# EAGLE design untitled (EAGLE 8.6.0)
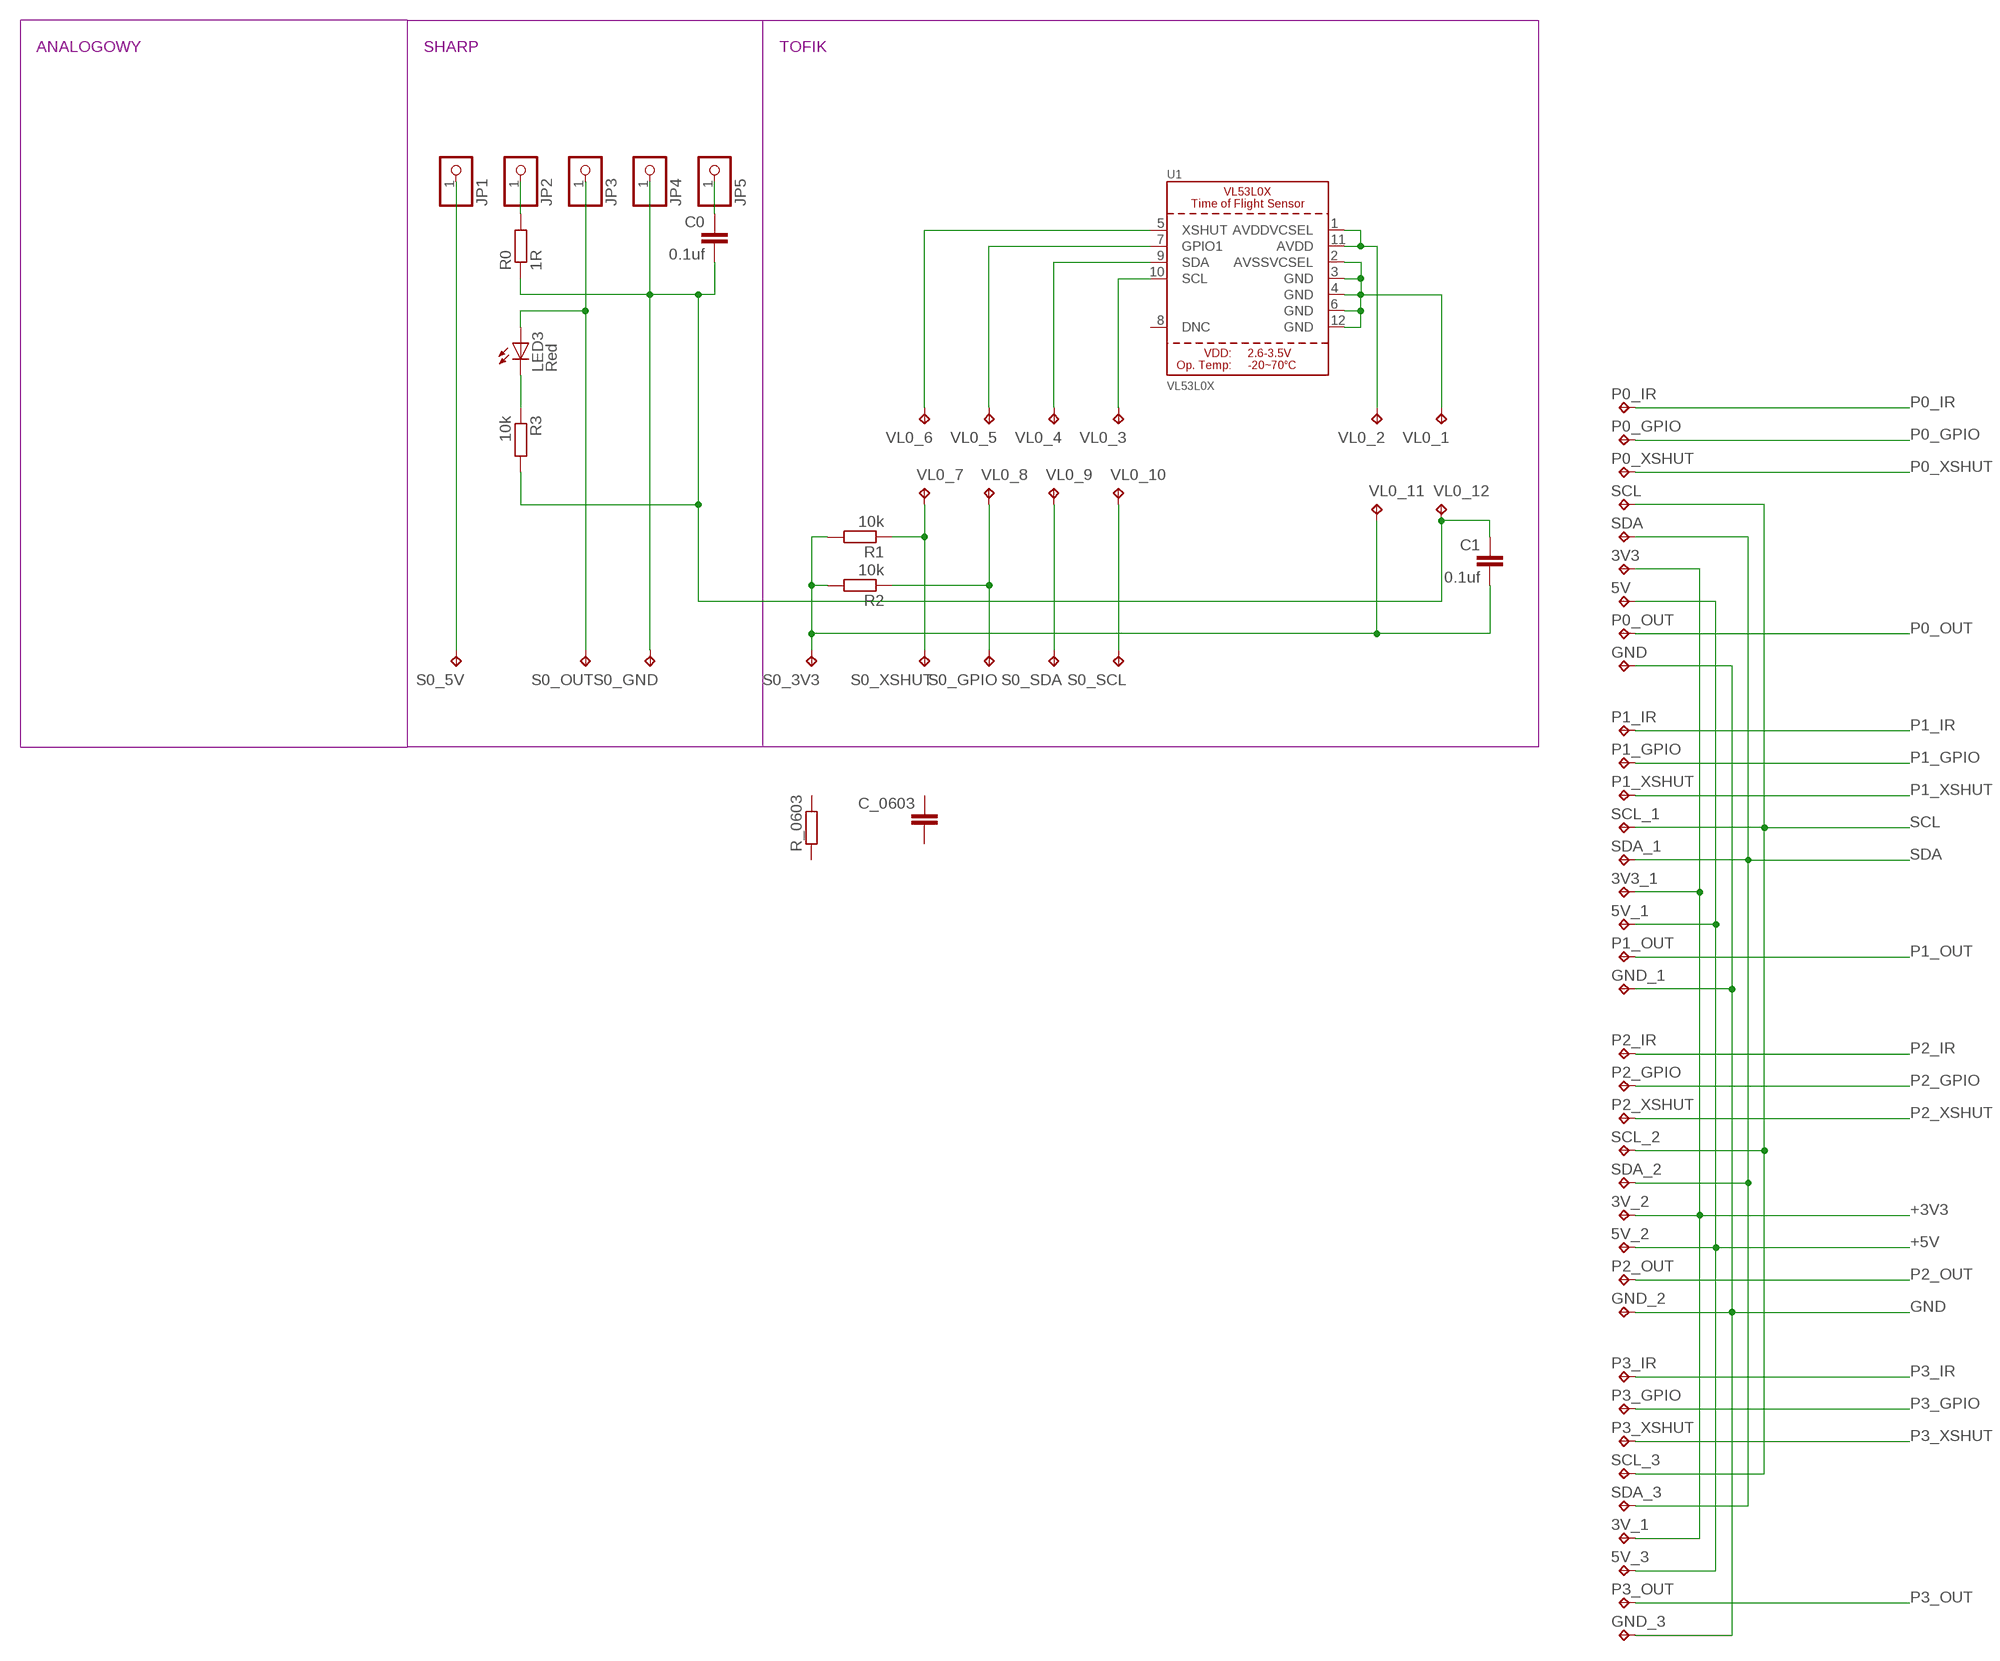
[diagram p0: schematic, sheet 1, part 1 of 2]
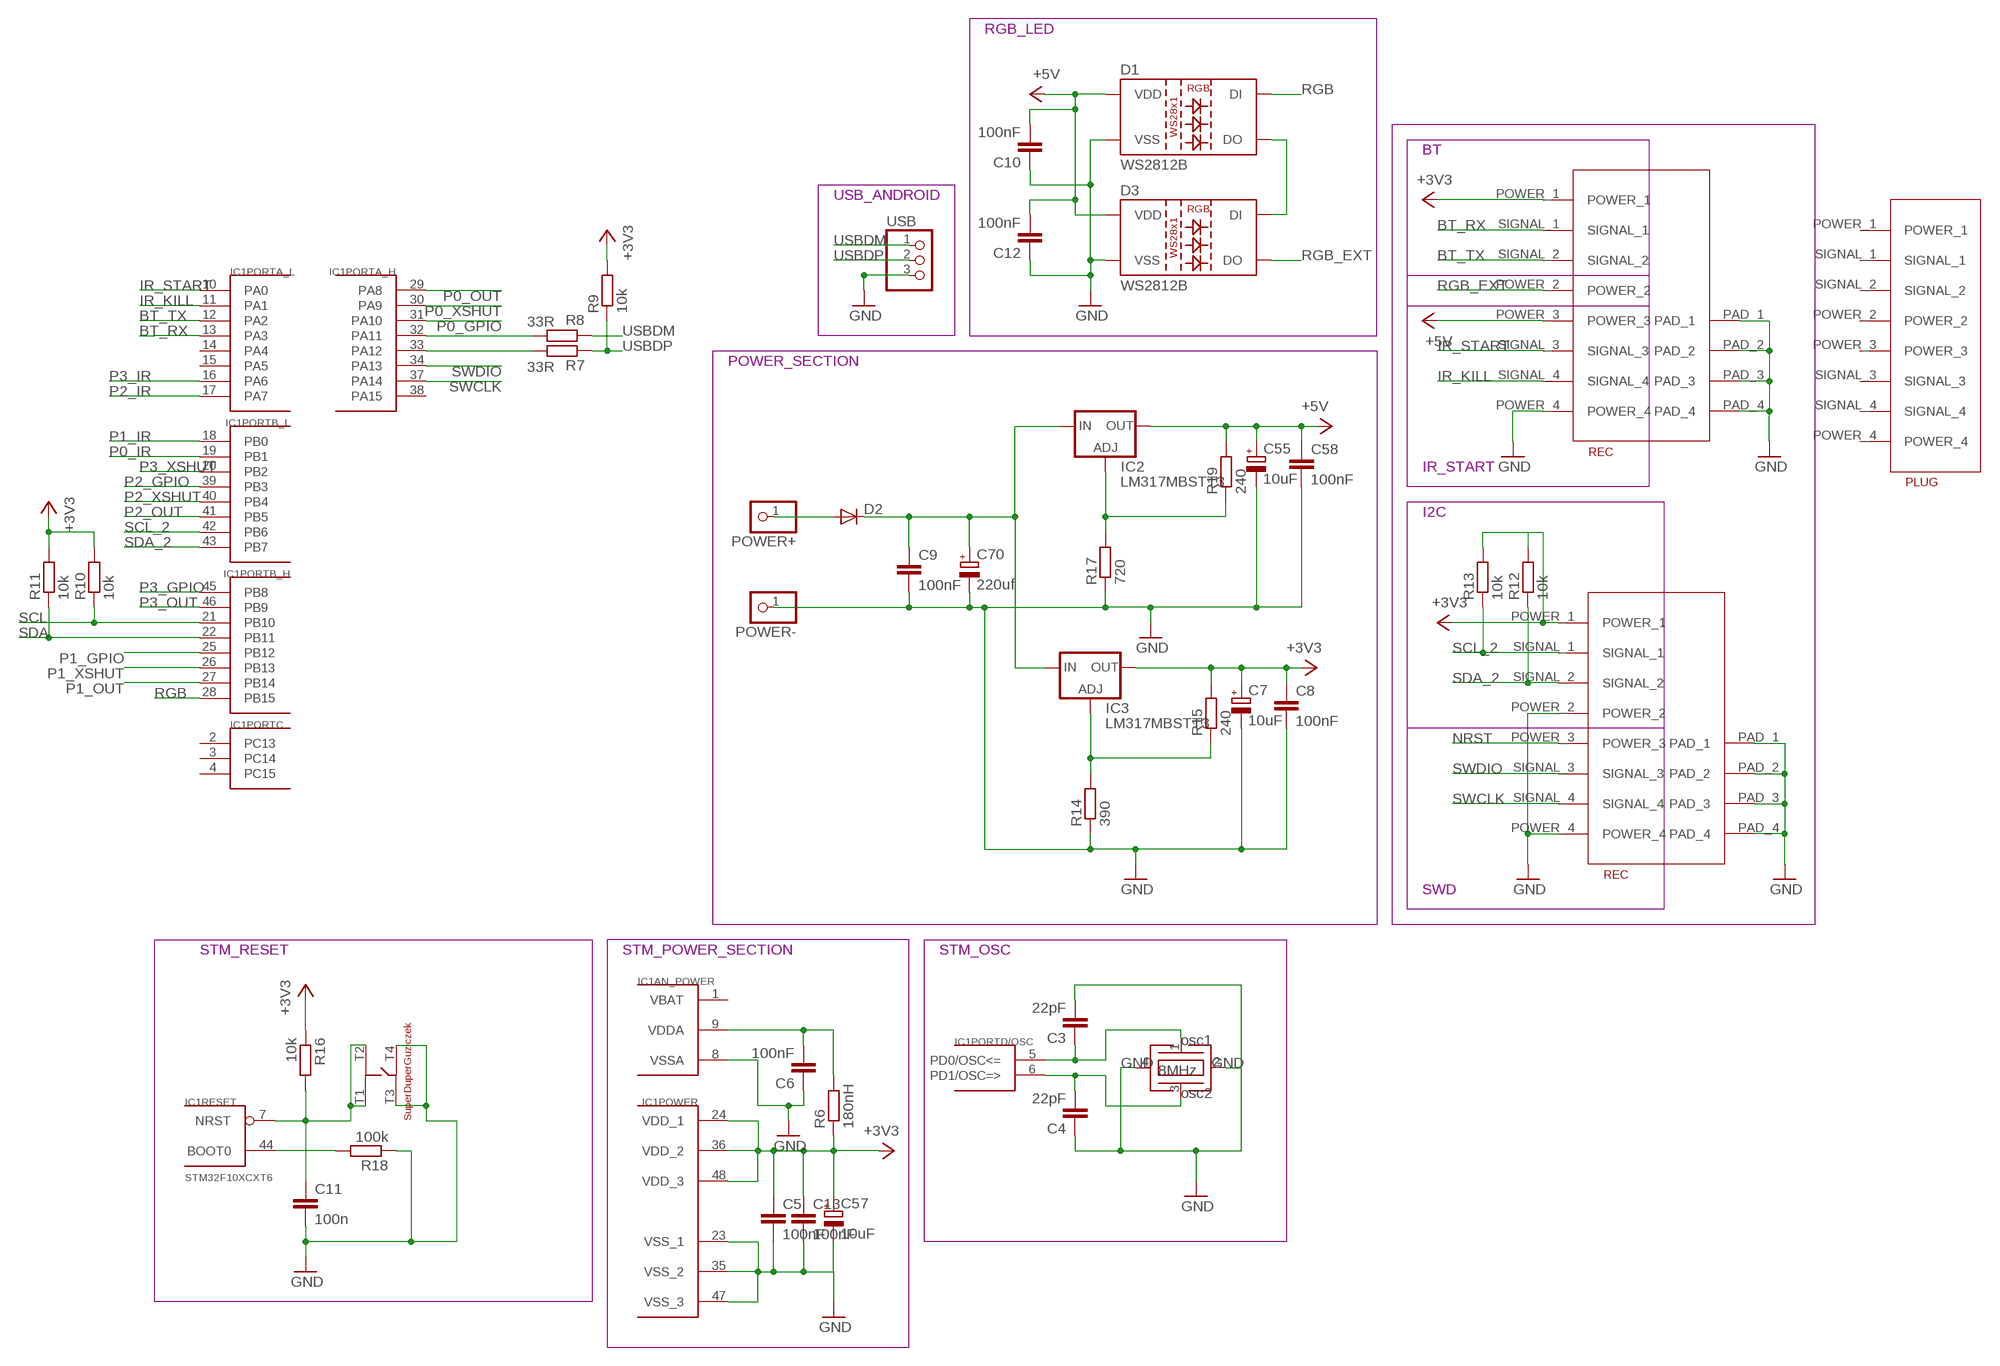
[diagram p1: schematic, sheet 1, part 2 of 2]

## Parts
3V3  TPTP09SQ  [TP09SQ]
3V3_1  TPTP09SQ  [TP09SQ]
3V_1  TPTP09SQ  [TP09SQ]
3V_2  TPTP09SQ  [TP09SQ]
5V  TPTP09SQ  [TP09SQ]
5V_1  TPTP09SQ  [TP09SQ]
5V_2  TPTP09SQ  [TP09SQ]
5V_3  TPTP09SQ  [TP09SQ]
C0  0.1uf  C-EUC0603  [C0603]
C1  0.1uf  C-EUC0603  [C0603]
C3  22pF  C-EUC0603  [C0603]
C4  22pF  C-EUC0603  [C0603]
C5  100nF  C-EUC0603  [C0603]
C6  100nF  C-EUC0603  [C0603]
C7  10uF  CPOL-EUSMCA  [SMC_A]
C8  100nF  C-EUC0603  [C0603]
C9  100nF  C-EUC0603  [C0603]
C10  100nF  C-EUC0603  [C0603]
C11  100n  C-EUC0603  [C0603]
C12  100nF  C-EUC0603  [C0603]
C13  100nF  C-EUC0603  [C0603]
C55  10uF  CPOL-EUSMCA  [SMC_A]
C57  10uF  CPOL-EUSMCA  [SMC_A]
C58  100nF  C-EUC0603  [C0603]
C70  220uf  CPOL-EU150CLZ-0810  [150CLZ-0810]
C_0603  C-EUC0603  [C0603]
D1  WS2812B  [WS2812B]
D2  DIODE-DO214BA  [DO214BA]
D3  WS2812B  [WS2812B]
GND  TPTP09SQ  [TP09SQ]
GND_1  TPTP09SQ  [TP09SQ]
GND_2  TPTP09SQ  [TP09SQ]
GND_3  TPTP09SQ  [TP09SQ]
IC1  STM32F10XCXT6  [TQFP48]
IC2  LM317MBSTT3  [SOT223]
IC3  LM317MBSTT3  [SOT223]
JP1  PINHD-1X1  [1X01]
JP2  PINHD-1X1  [1X01]
JP3  PINHD-1X1  [1X01]
JP4  PINHD-1X1  [1X01]
JP5  PINHD-1X1  [1X01]
LED3  Red  LEDSML0603  [SML0603]
P0_GPIO  TPTP09SQ  [TP09SQ]
P0_IR  TPTP09SQ  [TP09SQ]
P0_OUT  TPTP09SQ  [TP09SQ]
P0_XSHUT  TPTP09SQ  [TP09SQ]
P1_GPIO  TPTP09SQ  [TP09SQ]
P1_IR  TPTP09SQ  [TP09SQ]
P1_OUT  TPTP09SQ  [TP09SQ]
P1_XSHUT  TPTP09SQ  [TP09SQ]
P2_GPIO  TPTP09SQ  [TP09SQ]
P2_IR  TPTP09SQ  [TP09SQ]
P2_OUT  TPTP09SQ  [TP09SQ]
P2_XSHUT  TPTP09SQ  [TP09SQ]
P3_GPIO  TPTP09SQ  [TP09SQ]
P3_IR  TPTP09SQ  [TP09SQ]
P3_OUT  TPTP09SQ  [TP09SQ]
P3_XSHUT  TPTP09SQ  [TP09SQ]
POWER+  PINHD-1X1  [1X01]
POWER-  PINHD-1X1  [1X01]
R0  1R  R-EU_R0603  [R0603]
R1  10k  R-EU_R0603  [R0603]
R2  10k  R-EU_R0603  [R0603]
R3  10k  R-EU_R0603  [R0603]
R6  180nH  R-EU_R0603  [R0603]
R7  33R  R-EU_R0603  [R0603]
R8  33R  R-EU_R0603  [R0603]
R9  10k  R-EU_R0603  [R0603]
R10  10k  R-EU_R0603  [R0603]
R11  10k  R-EU_R0603  [R0603]
R12  10k  R-EU_R0603  [R0603]
R13  10k  R-EU_R0603  [R0603]
R14  390  R-EU_R0603  [R0603]
R15  240  R-EU_R0603  [R0603]
R16  10k  R-EU_R0603  [R0603]
R17  720  R-EU_R0603  [R0603]
R18  100k  R-EU_R0603  [R0603]
R19  240  R-EU_R0603  [R0603]
R_0603  R-EU_R0603  [R0603]
S0_3V3  TPTP09SQ  [TP09SQ]
S0_5V  TPTP09SQ  [TP09SQ]
S0_GND  TPTP09SQ  [TP09SQ]
S0_GPIO  TPTP09SQ  [TP09SQ]
S0_OUT  TPTP09SQ  [TP09SQ]
S0_SCL  TPTP09SQ  [TP09SQ]
S0_SDA  TPTP09SQ  [TP09SQ]
S0_XSHUT  TPTP09SQ  [TP09SQ]
SCL  TPTP09SQ  [TP09SQ]
SCL_1  TPTP09SQ  [TP09SQ]
SCL_2  TPTP09SQ  [TP09SQ]
SCL_3  TPTP09SQ  [TP09SQ]
SDA  TPTP09SQ  [TP09SQ]
SDA_1  TPTP09SQ  [TP09SQ]
SDA_2  TPTP09SQ  [TP09SQ]
SDA_3  TPTP09SQ  [TP09SQ]
U1  VL53L0X  [LGA12_ST]
U$1  MOLEG_REC_8X0.4MM  [REC]
U$2  MOLEX_PLUG_8X0.4MM  [PLUG]
U$3  MOLEG_REC_8X0.4MM  [REC]
U$27  SUPER_DUPER_GUZICZEK  [SUPER_DUPER_GUZICZEK]
U$35  8MHZ  [SMD]
USB  PINHD-1X3  [1X03]
VL0_1  TPTP09SQ  [TP09SQ]
VL0_2  TPTP09SQ  [TP09SQ]
VL0_3  TPTP09SQ  [TP09SQ]
VL0_4  TPTP09SQ  [TP09SQ]
VL0_5  TPTP09SQ  [TP09SQ]
VL0_6  TPTP09SQ  [TP09SQ]
VL0_7  TPTP09SQ  [TP09SQ]
VL0_8  TPTP09SQ  [TP09SQ]
VL0_9  TPTP09SQ  [TP09SQ]
VL0_10  TPTP09SQ  [TP09SQ]
VL0_11  TPTP09SQ  [TP09SQ]
VL0_12  TPTP09SQ  [TP09SQ]

## Nets
+3V3: 3V3.TP 3V3_1.TP 3V_1.TP 3V_2.TP C5.1 C7.+ C8.1 C13.1 C57.+ IC1.24(POWER:VDD_1) IC1.36(POWER:VDD_2) IC1.48(POWER:VDD_3) IC3.4(OUT) R6.1 R9.2 R10.2 R11.2 R12.2 R13.2 R15.2 R16.1 U$1.POWER_1 U$3.POWER_1
+5V: 5V.TP 5V_1.TP 5V_2.TP 5V_3.TP C10.2 C12.2 C55.+ C58.1 D1.1(VDD) D3.1(VDD) IC2.4(OUT) R19.2 U$1.POWER_3
BT_RX: IC1.13(PORTA_L:PA3) U$1.SIGNAL_1
BT_TX: IC1.12(PORTA_L:PA2) U$1.SIGNAL_2
GND: C3.2 C4.1 C5.2 C6.1 C7.- C8.2 C9.2 C10.1 C11.2 C12.1 C13.2 C55.- C57.- C58.2 C70.- D1.3(VSS) D3.3(VSS) GND.TP GND_1.TP GND_2.TP GND_3.TP IC1.8(AN_POWER:VSSA) IC1.23(POWER:VSS_1) IC1.35(POWER:VSS_2) IC1.47(POWER:VSS_3) POWER-.1 R14.1 R17.1 R18.1 U$1.PAD_1 U$1.PAD_2 U$1.PAD_3 U$1.PAD_4 U$1.POWER_4 U$3.PAD_1 U$3.PAD_2 U$3.PAD_3 U$3.PAD_4 U$3.POWER_2 U$3.POWER_4 U$27.T3 U$27.T4 U$35.2(GND2) U$35.4(GND1) USB.3
GND_TOFIK: U1.2(AVSSVCSEL) U1.3(GND) U1.4(GND) U1.6(GND) U1.12(GND) VL0_1.TP
IR_KILL: IC1.11(PORTA_L:PA1) U$1.SIGNAL_4
IR_START: IC1.10(PORTA_L:PA0) U$1.SIGNAL_3
N$1: JP2.1 R0.2
N$2: C0.1 JP5.1
N$4: LED3.C R3.1
N$15: U1.10(SCL) VL0_3.TP
N$16: U1.1(AVDDVCSEL) U1.11(AVDD) VL0_2.TP
N$17: U1.9(SDA) VL0_4.TP
N$18: U1.7(GPIO1) VL0_5.TP
N$19: U1.5(XSHUT) VL0_6.TP
N$74: IC3.1(ADJ) R14.2 R15.1
N$75: D2.A POWER+.1
N$76: C9.1 C70.+ D2.C IC2.3(IN) IC3.3(IN)
N$78: IC2.1(ADJ) R17.2 R19.1
N$79: IC1.44(RESET:BOOT0) R18.2
N$81: D1.2(DO) D3.4(DI)
N$128: IC1.33(PORTA_H:PA12) R7.2
N$129: IC1.32(PORTA_H:PA11) R8.2
N$130: C6.2 IC1.9(AN_POWER:VDDA) R6.2
N$131: C3.1 IC1.5(PORTD/OSC:PD0/OSC<=) U$35.1
N$132: C4.2 IC1.6(PORTD/OSC:PD1/OSC=>) U$35.3
NRST: C11.1 IC1.7(RESET:NRST) R16.2 U$3.POWER_3 U$27.T1 U$27.T2
P0_GPIO: IC1.31(PORTA_H:PA10) P0_GPIO.TP
P0_IR: IC1.19(PORTB_L:PB1) P0_IR.TP
P0_OUT: IC1.29(PORTA_H:PA8) P0_OUT.TP
P0_XSHUT: IC1.30(PORTA_H:PA9) P0_XSHUT.TP
P1_GPIO: IC1.25(PORTB_H:PB12) P1_GPIO.TP
P1_IR: IC1.18(PORTB_L:PB0) P1_IR.TP
P1_OUT: IC1.27(PORTB_H:PB14) P1_OUT.TP
P1_XSHUT: IC1.26(PORTB_H:PB13) P1_XSHUT.TP
P2_GPIO: IC1.39(PORTB_L:PB3) P2_GPIO.TP
P2_IR: IC1.17(PORTA_L:PA7) P2_IR.TP
P2_OUT: IC1.41(PORTB_L:PB5) P2_OUT.TP
P2_XSHUT: IC1.40(PORTB_L:PB4) P2_XSHUT.TP
P3_GPIO: IC1.45(PORTB_H:PB8) P3_GPIO.TP
P3_IR: IC1.16(PORTA_L:PA6) P3_IR.TP
P3_OUT: IC1.46(PORTB_H:PB9) P3_OUT.TP
P3_XSHUT: IC1.20(PORTB_L:PB2) P3_XSHUT.TP
RGB: D1.4(DI) IC1.28(PORTB_H:PB15)
RGB_EXT: D3.2(DO) U$1.POWER_2
S0_3V3: C1.2 R1.2 R2.2 S0_3V3.TP VL0_11.TP
S0_5V: JP1.1 S0_5V.TP
S0_GND: C0.2 C1.1 JP4.1 R0.1 R3.2 S0_GND.TP VL0_12.TP
S0_GPIO: R2.1 S0_GPIO.TP VL0_8.TP
S0_OUT: JP3.1 LED3.A S0_OUT.TP
S0_SCL: S0_SCL.TP VL0_10.TP
S0_SDA: S0_SDA.TP VL0_9.TP
S0_XSHUT: R1.1 S0_XSHUT.TP VL0_7.TP
SCL: IC1.21(PORTB_H:PB10) R10.1 SCL.TP SCL_1.TP SCL_2.TP SCL_3.TP
SCL_2: IC1.42(PORTB_L:PB6) R13.1 U$3.SIGNAL_1
SDA: IC1.22(PORTB_H:PB11) R11.1 SDA.TP SDA_1.TP SDA_2.TP SDA_3.TP
SDA_2: IC1.43(PORTB_L:PB7) R12.1 U$3.SIGNAL_2
SWCLK: IC1.37(PORTA_H:PA14) U$3.SIGNAL_4
SWDIO: IC1.34(PORTA_H:PA13) U$3.SIGNAL_3
USBDM: R8.1 USB.1
USBDP: R7.1 R9.1 USB.2
Unconnected: C_0603.1 C_0603.2 IC1.2(PORTC:PC13) IC1.3(PORTC:PC14) IC1.4(PORTC:PC15) IC1.14(PORTA_L:PA4) IC1.15(PORTA_L:PA5) IC1.38(PORTA_H:PA15) R_0603.1 R_0603.2 U1.8(DNC) U$2.POWER_1 U$2.POWER_2 U$2.POWER_3 U$2.POWER_4 U$2.SIGNAL_1 U$2.SIGNAL_2 U$2.SIGNAL_3 U$2.SIGNAL_4

## Notes on the sheet
- ANALOGOWY | SHARP | TOFIK
- RGB_LED
- BT
- USB_ANDROID
- POWER_SECTION
- IR_START
- I2C
- SWD
- STM_RESET | STM_POWER_SECTION | STM_OSC

## Power pins joined to a net without a drawn wire
VBAT: IC1.1(AN_POWER:VBAT)

## Library data of the parts
3V3 3V3_1 3V_1 3V_2 5V 5V_1-5V_3 GND GND_1-GND_3 P0_GPIO P0_IR P0_OUT P0_XSHUT P1_GPIO P1_IR P1_OUT P1_XSHUT P2_GPIO P2_IR P2_OUT P2_XSHUT P3_GPIO P3_IR P3_OUT P3_XSHUT S0_3V3 S0_5V S0_GND S0_GPIO S0_OUT S0_SCL S0_SDA S0_XSHUT SCL SCL_1-SCL_3 SDA SDA_1-SDA_3 VL0_1-VL0_12 = testpad:TP: Test pad
C0 C1 C3-C6 C8-C13 C58 C_0603 = rcl:C-EU: CAPACITOR, European symbol; SPICEPREFIX: C
C7 C55 C57 C70 = rcl:CPOL-EU: POLARIZED CAPACITOR, European symbol; SPICEPREFIX: C
D1 D3 = SparkFun-LED:WS2812B: WS2812B SMD addressable RGB LED 5x5mm SMD LED with built-in controller IC. Color: Red/Green/Blue mC Rating: RGB: 390, 660, 180 mcd Forward Voltage: RGB: 2.0, 3.0, 3.0 V Packages:WS2812B SparkFun Products: Blynk Board - ESP8266 <https://www.sparkfun.com/products/13794>; PROD_ID: DIO-12503
D2 = diode:DIODE-: DIODE
IC1 = stm32:STM32F10XCXT6: ST STM32F101/103 48pin LQFP
IC2 IC3 = v-reg:LM317?*: 500 mA Adjustable Output Positive Voltage Regulator Source: http://www.onsemi.co.jp .. LM317M-D.PDF
JP1-JP5 POWER+ POWER- = adafruit:PINHD-1X1: Pin header 1x1 for 0.1" spacing With round pins
LED3 = led:LED: LED OSRAM: - CHIPLED LG R971, LG N971, LY N971, LG Q971, LY Q971, LO R971, LY R971 LH N974, LH R974 LS Q976, LO Q976, LY Q976 LO Q996 - Hyper CHIPLED LW Q18S LB Q993, LB Q99A, LB R99A - SideLED LS A670, LO A670, LY A670, LG A670, LP A670 LB A673, LV A673, LT A673, LW A673 LH A674 LY A675 LS A676, LA A676, LO A676, LY A676, LW A676 LS A679, LY A679, LG A679 - Hyper Micro SIDELED® LS Y876, LA Y876, LO Y876, LY Y876 LT Y87S - SmartLED LW L88C, LW L88S LB L89C, LB L89S, LG L890 LS L89K, LO L89K, LY L89K LS L896, LA L896, LO L896, LY L896 - TOPLED LS T670, LO T670, LY T670, LG T670, LP T670 LSG T670, LSP T670, LSY T670, LOP T670, LYG T670 LG T671, LOG T671, LSG T671 LB T673, LV T673, LT T673, LW T673 LH T674 LS T676, LA T676, LO T676, LY T676, LB T676, LH T676, LSB T676, LW T676 LB T67C, LV T67C, LT T67C, LS T67K, LO T67K, LY T67K, LW E67C LS E67B, LA E67B, LO E67B, LY E67B, LB E67C, LV E67C, LT E67C LW T67C LS T679, LY T679, LG T679 LS T770, LO T770, LY T770, LG T770, LP T770 LB T773, LV T773, LT T773, LW T773 LH T774 LS E675, LA E675, LY E675, LS T675 LS T776, LA T776, LO T776, LY T776, LB T776 LHGB T686 LT T68C, LB T68C - Hyper Mini TOPLED® LB M676 - Mini TOPLED Santana® LG M470 LS M47K, LO M47K, LY M47K Source: http://www.osram.convergy.de LUXEON: - LUMILED® LXK2-PW12-R00, LXK2-PW12-S00, LXK2-PW14-U00, LXK2-PW14-V00 LXK2-PM12-R00, LXK2-PM12-S00, LXK2-PM14-U00 LXK2-PE12-Q00, LXK2-PE12-R00, LXK2-PE12-S00, LXK2-PE14-T00, LXK2-PE14-U00 LXK2-PB12-K00, LXK2-PB12-L00, LXK2-PB12-M00, LXK2-PB14-N00, LXK2-PB14-P00, LXK2-PB14-Q00 LXK2-PR12-L00, LXK2-PR12-M00, LXK2-PR14-Q00, LXK2-PR14-R00 LXK2-PD12-Q00, LXK2-PD12-R00, LXK2-PD12-S00 LXK2-PH12-R00, LXK2-PH12-S00 LXK2-PL12-P00, LXK2-PL12-Q00, LXK2-PL12-R00 Source: www.luxeon.com KINGBRIGHT: KA-3528ASYC Source: www.kingbright.com
R0 R1-R3 R6-R19 R_0603 = resistor:R-EU_: RESISTOR, European symbol
U1 = microbuilder:VL53L0X: VL53L0X - Laser Time of Flight Sensor (2M range)
U$1 U$3 = MOLEX:MOLEG_REC_8X0.4MM
U$2 = MOLEX:MOLEX_PLUG_8X0.4MM
U$27 = SuperDuperGuziczek:SUPER_DUPER_GUZICZEK
U$35 = cfpx-104-8mhz:8MHZ
USB = adafruit:PINHD-1X3: PIN HEADER

## Board
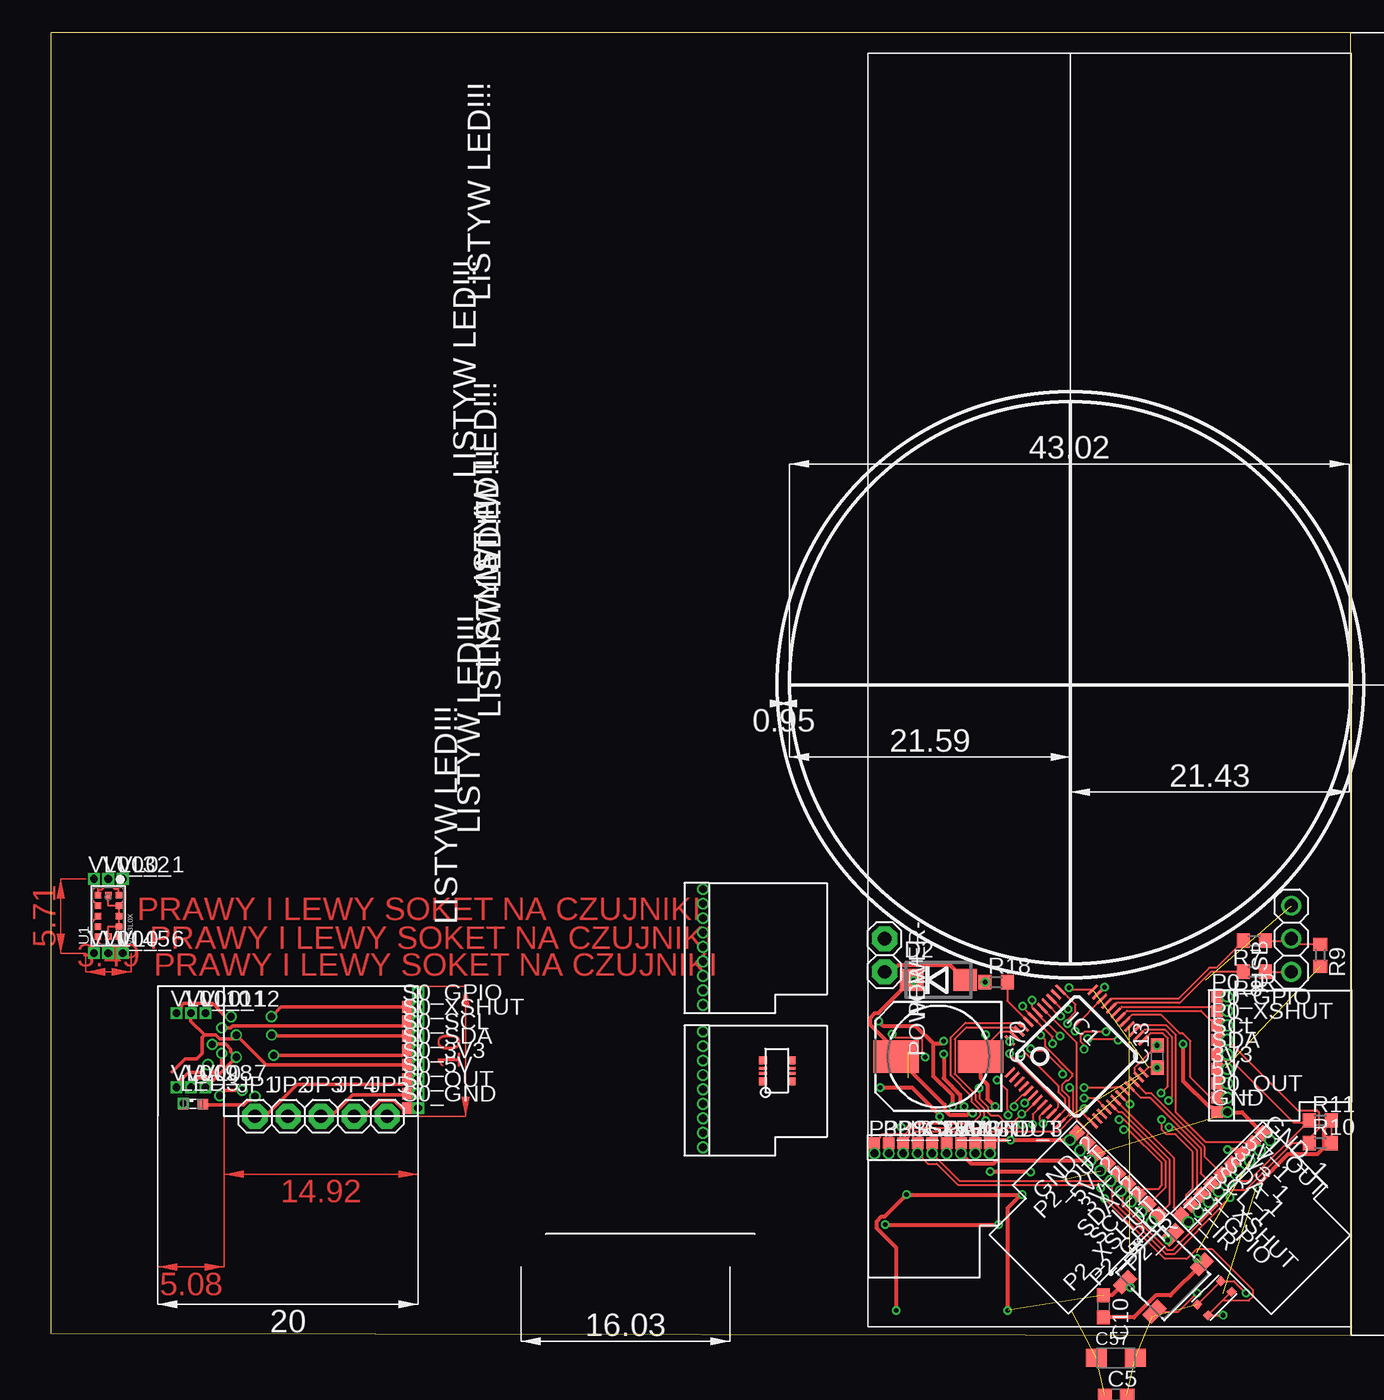
[diagram p2: board, top side]
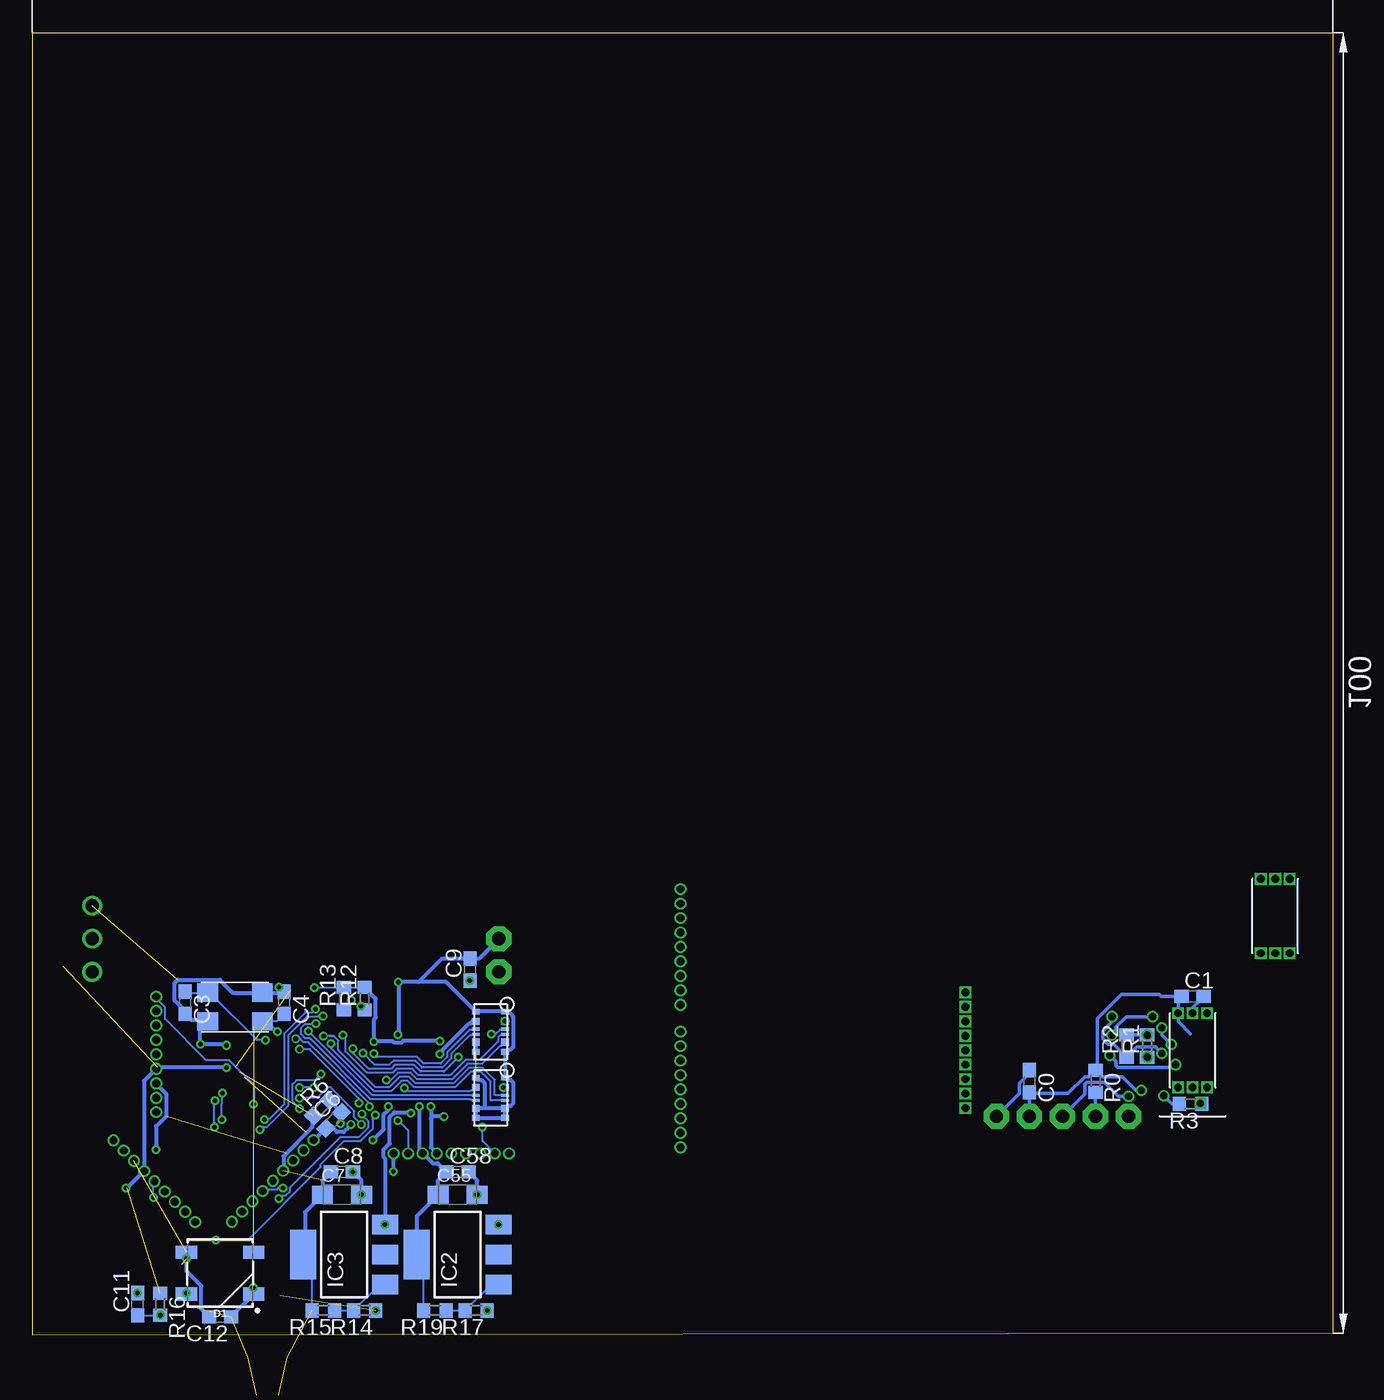
[diagram p3: board, bottom side, seen from below]

Size 99.99 x 100.16 mm. Coordinates in mm from the lower left corner, seen from the top.
Outline: 0,0.16 99.99,0 99.99,100.16 0,100.16 0,0.16
Copper layers (1*16): Top 0.035mm / dielectric 1.5mm / Bottom 0.035mm
Design rules "default *": minimum track width 6mil, minimum drill 0.35mm, track to track 6mil, track to pad 6mil, pad to pad 6mil, via to via 6mil, smd to smd 6mil, copper to edge 6mil, drill to drill 6mil, minimum pad ring 6mil, minimum via ring 6mil, stop-mask expansion 4mil, vias tented up to drill 0mil, thermal gap 10mil

### Footprints (pad centres in the part's own frame; a part is rotated, then mirrored left to right if it is on the bottom)
TP09SQ = smd 0.9 x 0.9: TP 0,0
C0603 = smd 1.1 x 1: 1 -0.85,0; 2 0.85,0
SMC_A = smd 1.6 x 1.4: + -1.5,0; - 1.5,0
150CLZ-0810 = smd 3.5 x 2.5: + 3.25,0; - -3.25,0
WS2812B = smd 1.651 x 1: 1 2.577,-1.6; 2 2.577,1.6; 3 -2.577,1.6; 4 -2.577,-1.6
DO214BA = smd 1.8 x 1.7: A 2.05,0; C -2.05,0
TQFP48 = smd 0.2 x 1: 1 -2.75,-4.5; 2 -2.25,-4.5; 3 -1.75,-4.5; 4 -1.25,-4.5; 5 -0.75,-4.5; 6 -0.25,-4.5; 7 0.25,-4.5; 8 0.75,-4.5; 9 1.25,-4.5; 10 1.75,-4.5; 11 2.25,-4.5; 12 2.75,-4.5; 25 2.75,4.5; 26 2.25,4.5; 27 1.75,4.5; 28 1.25,4.5; 29 0.75,4.5; 30 0.25,4.5; 31 -0.25,4.5; 32 -0.75,4.5; 33 -1.25,4.5; 34 -1.75,4.5; 35 -2.25,4.5; 36 -2.75,4.5 | smd 1 x 0.2: 13 4.5,-2.75; 14 4.5,-2.25; 15 4.5,-1.75; 16 4.5,-1.25; 17 4.5,-0.75; 18 4.5,-0.25; 19 4.5,0.25; 20 4.5,0.75; 21 4.5,1.25; 22 4.5,1.75; 23 4.5,2.25; 24 4.5,2.75; 37 -4.5,2.75; 38 -4.5,2.25; 39 -4.5,1.75; 40 -4.5,1.25; 41 -4.5,0.75; 42 -4.5,0.25; 43 -4.5,-0.25; 44 -4.5,-0.75; 45 -4.5,-1.25; 46 -4.5,-1.75; 47 -4.5,-2.25; 48 -4.5,-2.75
SOT223 = smd 1.5 x 2: 1 -2.3,-3.15; 2 0,-3.15; 3 2.3,-3.15 | smd 3.8 x 2: 4 0,3.15
1X01 = drill 1.016 pad 1.93 octagon: 1 0,0
SML0603 = smd 0.8 x 0.8: A 0.75,0; C -0.75,0
R0603 = smd 1 x 1.1: 1 -0.85,0; 2 0.85,0
LGA12_ST = smd 0.5 x 0.5: 1 1.6,-0.8; 2 0.8,-0.8; 3 0,-0.8; 4 -0.8,-0.8; 5 -1.6,-0.8; 6 -1.6,0; 7 -1.6,0.8; 8 -0.8,0.8; 9 0,0.8; 10 0.8,0.8; 11 1.6,0.8; 12 1.6,0
REC = smd 0.45 x 0.6: PAD_1 -0.75,0; PAD_2 2.35,0; PAD_3 -0.75,-2.25; PAD_4 2.35,-2.25 | smd 0.55 x 0.6: POWER_1 0,0; POWER_2 1.6,0; POWER_3 0,-2.25; POWER_4 1.6,-2.25 | smd 0.24 x 0.6: SIGNAL_1 0.6,0; SIGNAL_2 1,0; SIGNAL_3 0.6,-2.25; SIGNAL_4 1,-2.25
PLUG = smd 0.62 x 0.6: POWER_1 0,0; POWER_2 1.6,0; POWER_3 0,-2.2; POWER_4 1.6,-2.2 | smd 0.24 x 0.6: SIGNAL_1 0.6,0; SIGNAL_2 1,0; SIGNAL_3 0.6,-2.2; SIGNAL_4 1,-2.2
SUPER_DUPER_GUZICZEK = smd 0.57 x 0.55: T1 0,0; T2 2.55,0; T3 0,-1.16; T4 2.55,-1.16
SMD = smd 1.6 x 1.4: 1 0,2.2; 2 4.2,2.2; 3 4.2,0; 4 0,0
1X03 = drill 1.016: 1 -2.54,0; 2 0,0; 3 2.54,0

### Placement (x,y rotation side)
3V3  89.69,20.48 0 top
3V3_1  90.85,13.18 315 top
3V_1  68.9,14.76 0 top
3V_2  81.29,13.21 225 top
5V  89.69,19.37 0 top
5V_1  91.63,13.97 315 top
5V_2  80.5,13.99 225 top
5V_3  70.01,14.76 0 top
C0  23.34,19.53 270 bottom
C1  10.79,26.04 0 bottom
C3  88.27,25.56 270 bottom
C4  80.64,25.56 270 bottom
C5  81.92,-4.6 0 top  (outside the outline)
C6  76.83,16.51 45 bottom
C7  76.2,10.79 0 bottom
C8  76.2,12.54 0 bottom
C9  66.36,28.1 90 bottom
C10  80.96,2.22 270 top
C11  91.92,2.38 90 bottom
C12  85.57,1.43 180 bottom
C13  85.09,21.43 90 top
C55  67.31,10.79 0 bottom
C57  81.92,-1.75 0 top
C58  67.31,12.54 0 bottom
C70  68.26,21.43 180 top
C_0603  -24.13,-6.03 0 top  (outside the outline)
D1  85.57,4.76 180 bottom
D2  68.26,27.3 0 top
D3  85.57,4.76 45 top
GND  89.69,17.14 0 top
GND_1  93.2,15.54 315 top
GND_2  78.93,15.56 225 top
GND_3  72.23,14.76 0 top
IC1  78.9,21.43 315 top
IC2  67.31,6.19 90 bottom
IC3  76.04,6.19 90 bottom
JP1  15.72,16.83 0 top
JP2  18.26,16.83 0 top
JP3  20.8,16.83 0 top
JP4  23.34,16.83 0 top
JP5  25.88,16.83 0 top
LED3  10.95,17.78 0 top
P0_GPIO  89.69,24.92 0 top
P0_IR  89.69,26.04 0 top
P0_OUT  89.69,18.26 0 top
P0_XSHUT  89.69,23.81 0 top
P1_GPIO  87.7,10.04 315 top
P1_IR  86.92,9.25 315 top
P1_OUT  92.42,14.75 315 top
P1_XSHUT  88.49,10.82 315 top
P2_GPIO  84.43,10.06 225 top
P2_IR  85.22,9.28 225 top
P2_OUT  79.72,14.78 225 top
P2_XSHUT  83.65,10.85 225 top
P3_GPIO  64.45,14.76 0 top
P3_IR  63.34,14.76 0 top
P3_OUT  71.12,14.76 0 top
P3_XSHUT  65.56,14.76 0 top
POWER+  64.14,27.94 270 top
POWER-  64.14,30.48 270 top
R0  18.26,19.53 270 bottom
R1  14.29,22.23 90 bottom
R2  15.88,22.23 90 bottom
R3  10.95,17.78 180 bottom
R6  77.79,17.46 45 bottom
R7  92.55,30.32 180 top
R8  92.55,27.94 180 top
R9  97.63,29.21 270 top
R10  97.63,14.76 0 top
R11  97.63,16.51 0 top
R12  74.45,25.88 90 bottom
R13  76.04,25.88 90 bottom
R14  74.45,1.91 180 bottom
R15  77.63,1.91 180 bottom
R16  90.17,2.38 270 bottom
R17  65.88,1.91 180 bottom
R18  72.71,27.15 0 top
R19  69.06,1.91 180 bottom
R_0603  -6.03,-15.08 0 top  (outside the outline)
S0_3V3  27.46,20.8 0 top
S0_5V  27.46,19.69 0 top
S0_GND  27.46,17.46 0 top
S0_GPIO  27.46,25.24 0 top
S0_OUT  27.46,18.57 0 top
S0_SCL  27.46,23.02 0 top
S0_SDA  27.46,21.91 0 top
S0_XSHUT  27.46,24.13 0 top
SCL  89.69,22.7 0 top
SCL_1  89.27,11.61 315 top
SCL_2  82.86,11.64 225 top
SCL_3  66.67,14.76 0 top
SDA  89.69,21.59 0 top
SDA_1  90.06,12.4 315 top
SDA_2  82.08,12.42 225 top
SDA_3  67.79,14.76 0 top
U1  4.45,32.23 90 top
U$1  63.66,24.13 270 bottom
U$2  54.77,19.53 90 top
U$3  63.66,19.05 270 bottom
U$27  90.81,3.33 225 top
U$35  86.52,24.13 0 bottom
USB  95.41,30.48 90 top
VL0_1  5.56,35.08 0 top
VL0_2  4.45,35.08 0 top
VL0_3  3.33,35.08 0 top
VL0_4  3.33,29.37 0 top
VL0_5  4.45,29.37 0 top
VL0_6  5.56,29.37 0 top
VL0_7  11.91,19.05 0 top
VL0_8  10.79,19.05 0 top
VL0_9  9.68,19.05 0 top
VL0_10  9.68,24.77 0 top
VL0_11  10.79,24.77 0 top
VL0_12  11.91,24.77 0 top

### Tracks (layer width: path | path; a pad name or v marks a point on that pad's centre or on a via)
+3V3  (via drill 0.35, 0.6)  (7 unrouted)
  Top 0.152: R11.2 R10.2 | C13.1 84.41,20.58 IC1.24 | IC1.36 78.48,26.56 v78.32,26.72 | IC1.48 73.74,22.64 v73.74,22.59
  Top 0.305: R11.2 97.89,15.92 97.89,14.39 97.41,13.91 95.15,13.91 92.81,11.57 v92.81,11.33 | U$1.POWER_1 63.99,23.79 66.51,23.79 67.87,22.43 | 67.87,22.43 67.87,19.91 69.36,18.42 v69.36,17.59 | v63.8,19.05 66.23,19.05 68.35,16.93 v68.35,16.82 | 67.87,22.43 68.49,22.43 v68.67,22.61
  Top 0.813: v90.49,20.48 3V3.TP | v91.41,12.62 3V3_1.TP | v80.73,12.65 3V_2.TP | v68.9,13.97 3V_1.TP
  Bottom 0.152: R15.2 78.48,5.48 79.05,6.04 IC3.4 78.42,6.96 78.42,7.14 | R12.2 R13.2 v78.32,26.72
  Bottom 0.305: v92.81,11.33 92.7,11.33 v91.41,12.62 91.41,19.56 v90.49,20.48 90.39,20.58 C13.1 | U$3.POWER_1 | U$3.POWER_1 v63.8,19.05 | v69.36,17.59 69.36,16.67 | 69.36,16.67 69.36,14.44 v68.9,13.97 | v68.35,16.82 69.22,16.82 69.36,16.67 | R12.2 73.6,25.87 73.6,24.4 73.74,24.26 v73.74,22.59 72.27,22.59 72.18,22.49 71.65,22.49 71.53,22.61 v68.67,22.61 | v80.73,12.65 80.7,12.67 80.7,13.77 78.48,15.98 78.48,16.48 78.23,16.73 R6.1 | C8.1 77.7,11.89 C7.+ 79.05,9.45 79.05,6.04
  other vias: 85.09,20.58 63.66,24.13
+5V  (via drill 0.35, 0.6)  (3 unrouted)
  Top 0.305: D3.1 86.12,3.05 84.98,3.05 83.3,1.37 C10.2 | v90.49,14.28 91.32,14.28 5V_1.TP | v68.67,21.61 68.67,19.76 69.94,18.5 69.94,17.91 v70.26,17.59 | v79.94,13.43 72.76,13.43 72.55,13.21 70.77,13.21 v70.01,13.97
  Top 0.813: v90.49,19.37 5V.TP | v92.19,13.41 | v92.19,13.41 5V_1.TP | v79.94,13.43 5V_2.TP | v70.01,13.97 5V_3.TP
  Bottom 0.152: R19.2 69.91,5.64 IC2.4 69.53,7.12 | C55.+ 68.81,10.95 | 68.81,11.89 68.81,10.95 | 69.53,10.64 69.22,10.95 68.81,10.95
  Bottom 0.305: C12.2 87.01,2.03 87.01,3.79 88.14,4.92 v88.14,5.87 D1.1 | v90.49,19.37 90.49,19.33 89.73,18.57 89.73,16.83 90.49,16.07 v90.49,14.28 | v70.01,13.97 69.97,13.97 | 69.97,13.97 69.21,13.21 68.83,13.21 C58.1 68.81,11.89 C55.+ 70.46,9.14 IC2.4 | v68.67,21.61 68.48,21.8 68.48,21.91 66.44,23.95 66.33,23.95 66.16,24.13 U$1.POWER_3 | v70.26,17.59 70.26,14.26 69.97,13.97
BT_RX  (via drill 0.35)
  Top 0.152: v64.71,23.16 64.96,22.91 66.86,22.91 66.99,22.78 66.99,21.65 v67.24,21.39 | v79.45,17.44 79.45,16.99 IC1.13 | v75.37,22.05 75.51,21.91 76.34,21.91 77.81,20.44 v77.81,20.08
  Bottom 0.152: U$1.SIGNAL_1 63.71,23.48 64.05,23.48 64.37,23.16 v64.71,23.16 | v79.45,17.44 79.45,17.46 80.01,18.01 80.01,19.28 79.69,19.61 78.28,19.61 v77.81,20.08 | v67.24,21.39 68.36,20.28 70.17,20.28 70.67,20.78 72.14,20.78 72.44,20.48 74.16,20.48 75.37,21.69 v75.37,22.05
BT_TX  (via drill 0.35)
  Top 0.152: IC1.12 78.29,16.93 78.29,18.32 77.79,18.82 77.79,19.28 78.11,19.61 78.26,19.61 78.58,19.92 78.58,20.09 76.48,22.19 76.48,22.71 v76.12,23.07
  Bottom 0.152: U$1.SIGNAL_2 63.76,23.03 64.05,23.03 64.19,22.9 64.19,22.6 65.62,21.17 66.68,21.17 67.87,19.98 70.29,19.98 70.79,20.48 72.01,20.48 72.31,20.17 73.03,20.17 74.28,20.17 75.93,21.82 | 75.93,21.82 75.93,22.88 v76.12,23.07 | 75.93,21.82
GND  (via drill 0.35, 0.6)  (7 unrouted)
  Top 0.152: U$27.T4 U$27.T3 | U$27.T3 | U$27.T3 90.99,4.15 C11.2 | IC1.23 83.35,20.16 83.35,20.55 83.65,20.85 83.66,20.85 C13.2 | IC1.35 v81.04,26.75 | IC1.47 74.09,23.02 73.79,23.32 73.01,23.32 71.51,21.82 71.51,21.59 C70.- | 76.25,17.66 IC1.8 75.52,16.99 v75.52,16.21
  Top 0.305: C10.1 81.61,3.07 D3.3 v83.03,3.66 v83.03,3.65 | v90.49,17.14 91.6,17.14 v93.77,14.98 | GND.TP 89.34,17.5 89.12,17.5 87.09,19.53 v87.09,22.38 | v71.91,23.12 71.91,21.99 71.51,21.59 | GND_3.TP 72.47,15 v73.82,15 v78.37,15 | v72.26,12.58 75.31,12.58 C8.2 | C70.- 71.51,19.79 72.03,19.27 72.03,18.18 v72.62,17.59 | 74.61,10.79 C55.- 64.14,9.12 63.9,9.12 63.53,8.75 63.53,8.23 65.03,6.73 R17.1 | R14.1 73.6,9.79 74.61,10.79 | C7.- 74.61,10.79
  Top 0.813: v93.77,14.98 GND_1.TP | v78.37,15 GND_2.TP | v72.23,13.97 GND_3.TP | v90.49,17.14 GND.TP
  Bottom 0.152: 86.62,24.55 86.55,24.24 | 86.55,24.24 U$35.4 87.09,23.56 v87.09,22.38 | 80.72,26.33 C4.1 80.69,26.41 v81.04,26.75 | 87.79,24.24 87.15,24.24 87,24.24 86.55,24.24 | 82.55,26.33 U$35.2
  Bottom 0.305: C12.1 D1.3 82.99,3.61 v83.03,3.65 | C13.2 85.19,22.38 v87.09,22.38 87.09,24.18 87.15,24.24 | U$3.POWER_2 U$3.PAD_2 U$3.PAD_4 U$3.POWER_4 65.25,17.45 | U$3.POWER_2 65.25,17.45 | U$3.PAD_3 65.74,19.63 65.48,19.63 65.25,19.39 65.25,17.45 | U$3.POWER_2 63.48,17.62 63.23,17.62 63.05,17.8 63.05,19.45 63.23,19.63 63.49,19.63 U$3.PAD_1 U$1.PAD_2 63.49,21.95 63.23,21.95 63.03,22.16 63.03,24.5 63.28,24.76 63.54,24.76 U$1.PAD_1 U$1.PAD_3 68.17,27.15 70.33,27.15 | U$1.POWER_4 U$1.PAD_4 | POWER-.1 65.67,28.95 C9.2 68.52,28.95 70.33,27.15 | 70.33,27.15 R18.1 71.86,23.18 v71.91,23.12 | 87,24.24 87.79,24.24 87.8,24.24 C3.2 88.27,24.93 89.07,25.73 89.07,27.08 88.82,27.33 85.59,27.33 84.59,26.33 82.55,26.33 | U$35.2 80.72,26.33 | v78.37,15 78.34,15 C6.1 76.87,15.91 76.59,15.62 76.06,15.62 75.69,15.99 75.69,16.03 v75.52,16.21 | v72.23,13.97 72.26,13.94 v72.26,12.58 | C7.- 74.7,11.89 C8.2 | v72.62,17.59 72.62,17.33 72.99,16.96 72.99,15.84 v73.82,15 | C58.2 65.81,11.89 C55.-
  other vias: 91.92,3.23 85.09,22.28 71.86,27.15 75.35,12.54 65.81,10.79 74.7,10.79 65.03,1.91 73.6,1.91
GND_TOFIK  (via drill 0.6)
  Top 0.152: U1.2 U1.3 U1.4 4.45,31.43 U1.6 | U1.2 4.45,33.02 U1.12 | VL0_1.TP 5.56,34.34 5.72,34.17 5.72,33.48 5.59,33.35 5.57,33.35 U1.2
  other vias: 5.56,35.08
IR_KILL  (via drill 0.35)
  Top 0.152: v74.59,21.69 74.94,21.69 77.48,19.15 77.48,18.69 77.98,18.19 77.98,17.33 IC1.11
  Bottom 0.152: U$1.SIGNAL_4 66,23.03 66.39,23.03 67.8,21.62 67.8,21.27 68.48,20.59 70.04,20.59 70.54,21.09 72.26,21.09 72.56,20.78 73.68,20.78 v74.59,21.69
IR_START  (via drill 0.35)
  Top 0.152: v73.74,21.64 77.47,17.91 77.47,17.53 IC1.10
  Bottom 0.152: U$1.SIGNAL_3 65.96,23.48 66.38,23.48 68.1,21.75 68.1,21.4 68.61,20.89 69.91,20.89 70.41,21.39 73.5,21.39 v73.74,21.64 | v73.74,21.64
N$1
  Bottom 0.254: JP2.1 R0.2
N$2
  Bottom 0.254: JP5.1 24.12,18.59 24.12,19.34 23.34,20.12 C0.1
N$3  (via drill 0.6)
  other vias: 28.26,26.35
N$4  (via drill 0.55)
  Top 0.254: LED3.C v10.2,17.83
  Bottom 0.254: v10.2,17.83 10.15,17.78 R3.1
N$7  (via drill 0.6)
  other vias: 28.26,17.46
N$8  (via drill 0.6)
  other vias: 28.26,18.57
N$9  (via drill 0.6)
  other vias: 28.26,19.69
N$10  (via drill 0.6)
  other vias: 28.26,20.8
N$11  (via drill 0.6)
  other vias: 28.26,21.91
N$12  (via drill 0.6)
  other vias: 28.26,23.02
N$13  (via drill 0.6)
  other vias: 28.26,24.13
N$14  (via drill 0.6)
  other vias: 28.26,25.24
N$15  (via drill 0.6)
  Top 0.152: VL0_3.TP 3.33,34.34 3.17,34.17 3.17,33.48 3.3,33.35 3.32,33.35 U1.10
  other vias: 3.33,35.08
N$16  (via drill 0.6)
  Top 0.152: U1.11 3.65,34.29 3.97,34.29 4.45,34.77 | 4.45,34.77 VL0_2.TP | U1.1 5.24,34.29 4.92,34.29 4.45,34.77
  other vias: 4.45,35.08
N$17  (via drill 0.6)
  Top 0.152: VL0_4.TP 3.33,30.11 3.17,30.28 3.17,31.77 3.3,31.9 3.32,31.9 U1.9
  other vias: 3.33,29.37
N$18  (via drill 0.6)
  Top 0.152: VL0_5.TP 4.01,29.8 4.01,29.91 3.65,30.28 U1.7
  other vias: 4.45,29.37
N$19  (via drill 0.6)
  Top 0.152: U1.5 5.25,29.68 VL0_6.TP
  other vias: 5.56,29.37
N$20  (via drill 0.6)
  other vias: 50.16,34.29
N$21  (via drill 0.6)
  other vias: 50.16,33.18
N$22  (via drill 0.6)
  other vias: 50.16,32.07
N$23  (via drill 0.6)
  other vias: 50.16,30.96
N$24  (via drill 0.6)
  other vias: 50.16,29.85
N$25  (via drill 0.6)
  other vias: 50.16,28.73
N$26  (via drill 0.6)
  other vias: 50.16,27.62
N$27  (via drill 0.6)
  other vias: 50.16,26.51
N$28  (via drill 0.6)
  other vias: 50.16,25.4
N$29  (via drill 0.6)
  other vias: 50.16,23.34
N$30  (via drill 0.6)
  other vias: 50.16,22.23
N$31  (via drill 0.6)
  other vias: 50.16,21.11
N$32  (via drill 0.6)
  other vias: 50.16,20
N$33  (via drill 0.6)
  other vias: 50.16,18.89
N$34  (via drill 0.6)
  other vias: 50.16,17.78
N$35  (via drill 0.6)
  other vias: 50.16,16.67
N$36  (via drill 0.6)
  other vias: 50.16,15.56
N$37  (via drill 0.6)
  other vias: 50.16,14.45
N$47  (via drill 0.6)
  other vias: 118.86,29.7
N$48  (via drill 0.6)
  other vias: 118.07,28.92
N$49  (via drill 0.6)
  other vias: 117.29,28.13
N$50  (via drill 0.6)
  other vias: 116.5,27.35
N$51  (via drill 0.6)
  other vias: 115.72,26.56
N$52  (via drill 0.6)
  other vias: 114.93,25.78
N$53  (via drill 0.6)
  other vias: 114.15,24.99
N$54  (via drill 0.6)
  other vias: 113.36,24.2
N$55  (via drill 0.6)
  other vias: 112.57,23.42
N$56  (via drill 0.6)
  other vias: 121.65,29.68
N$57  (via drill 0.6)
  other vias: 122.44,28.89
N$58  (via drill 0.6)
  other vias: 123.23,28.11
N$59  (via drill 0.6)
  other vias: 124.01,27.32
N$60  (via drill 0.6)
  other vias: 124.8,26.54
N$61  (via drill 0.6)
  other vias: 125.58,25.75
N$62  (via drill 0.6)
  other vias: 126.37,24.96
N$63  (via drill 0.6)
  other vias: 127.15,24.18
N$64  (via drill 0.6)
  other vias: 127.94,23.39
N$65  (via drill 0.6)
  other vias: 124.62,12.22
N$66  (via drill 0.6)
  other vias: 124.62,13.33
N$67  (via drill 0.6)
  other vias: 124.62,14.45
N$68  (via drill 0.6)
  other vias: 124.62,15.56
N$69  (via drill 0.6)
  other vias: 124.62,16.67
N$70  (via drill 0.6)
  other vias: 124.62,17.78
N$71  (via drill 0.6)
  other vias: 124.62,18.89
N$72  (via drill 0.6)
  other vias: 124.62,20
N$73  (via drill 0.6)
  other vias: 124.62,21.11
N$74
  Bottom 0.152: R15.1 R14.2 73.32,3.89 IC3.1
N$75
  Top 0.305: POWER+.1 64.67,27.94 65.19,28.46 69.16,28.46 D2.A
N$76  (via drill 0.35)
  Top 0.305: 63.5,22.38 64.06,22.38 C70.+ | C70.+ 64.06,20.48 63.5,20.48 | 65.71,21.43 C70.+ | C70.+ 68.73,17.71 68.73,17.33 69.1,16.96 70.52,16.96 70.65,17.09 v70.9,17.09 | C70.+ 65.01,21.88 63.03,23.87 63.03,24.39 63.4,24.76 63.67,24.76 D2.C 66.27,27.25 C9.1 | IC2.3 IC3.3
  Bottom 0.305: IC3.3 72.89,13.56 72.99,13.66 72.99,14.28 72.53,14.74 72.53,16.77 72.16,17.14 70.86,17.14 | 70.85,17.14 70.86,17.14 | v70.9,17.09 70.9,17.1 70.86,17.14
  other vias: 66.36,27.25 64.16,8.49 72.89,8.49
N$78
  Bottom 0.152: R19.1 R17.2 64.75,3.89 IC2.1
N$79
  Top 0.152: R18.2 73.56,25.71 IC1.44
N$81  (via drill 0.35)
  Top 0.152: D3.4 86.73,1.81 v88.14,3.23
  Bottom 0.152: v88.14,3.23 D1.2
N$101  (via drill 0.6)
  other vias: 156.96,-12.08
N$102  (via drill 0.6)
  other vias: 156.17,-11.3
N$103  (via drill 0.6)
  other vias: 155.39,-10.51
N$104  (via drill 0.6)
  other vias: 154.6,-9.73
N$105  (via drill 0.6)
  other vias: 153.82,-8.94
N$106  (via drill 0.6)
  other vias: 153.03,-8.15
N$107  (via drill 0.6)
  other vias: 152.25,-7.37
N$108  (via drill 0.6)
  other vias: 151.46,-6.58
N$109  (via drill 0.6)
  other vias: 150.67,-5.8
N$110  (via drill 0.6)
  other vias: 159.75,-12.06
N$111  (via drill 0.6)
  other vias: 160.54,-11.27
N$112  (via drill 0.6)
  other vias: 161.33,-10.49
N$113  (via drill 0.6)
  other vias: 162.11,-9.7
N$114  (via drill 0.6)
  other vias: 162.9,-8.91
N$115  (via drill 0.6)
  other vias: 163.68,-8.13
N$116  (via drill 0.6)
  other vias: 164.47,-7.34
N$117  (via drill 0.6)
  other vias: 165.25,-6.56
N$118  (via drill 0.6)
  other vias: 166.04,-5.77
N$119  (via drill 0.6)
  other vias: 162.72,5.4
N$120  (via drill 0.6)
  other vias: 162.72,4.29
N$121  (via drill 0.6)
  other vias: 162.72,3.17
N$122  (via drill 0.6)
  other vias: 162.72,2.06
N$123  (via drill 0.6)
  other vias: 162.72,0.95
N$124  (via drill 0.6)
  other vias: 162.72,-0.16
N$125  (via drill 0.6)
  other vias: 162.72,-1.27
N$126  (via drill 0.6)
  other vias: 162.72,-2.38
N$127  (via drill 0.6)
  other vias: 162.72,-3.49
N$128
  Top 0.152: R7.2 89.62,28.24 89.09,28.24 86.7,25.85 81.55,25.85 IC1.33
N$129
  Top 0.152: R8.2 89.22,27.94 86.82,25.55 81.95,25.55 IC1.32
N$130  (via drill 0.35)
  Top 0.152: IC1.9 76.04,16.81 76.04,16.54 v76.33,16.25
  Bottom 0.152: 76.04,16.99 76.04,17.39 C6.2 | v76.33,16.25 76.33,16.77 76.11,16.99
  Bottom 0.305: 77.03,18.38 R6.2 76.11,16.99 76.04,16.99
N$131  (via drill 0.35)
  Top 0.152: IC1.5 74.84,18.43 74.68,18.43 74.1,17.85 v74.1,17.59 | v79.76,22.78 81.99,22.78 v82.07,22.7
  Bottom 0.152: C3.1 88.19,26.33 U$35.1 86.28,26.25 82.73,22.7 v82.07,22.7 | v74.1,17.59 74.14,17.62 74.14,17.87 77.66,21.4 78.79,22.53 79.15,22.53 79.4,22.78 v79.76,22.78
N$132  (via drill 0.35)
  Top 0.152: IC1.6 74.97,17.86 v74.91,17.86 | v79.45,21.98 79.45,22.3 79.2,22.55 79.2,23.01 79.53,23.34 v81.18,23.34
  Bottom 0.152: C4.2 81.22,24.13 81.97,24.13 | v74.91,17.86 74.91,18.21 78.67,21.98 v79.45,21.98 | v81.18,23.34 81.97,24.13 | U$35.3 81.97,24.13
NRST  (via drill 0.35)
  Top 0.152: U$27.T2 U$27.T1 | U$27.T2 R16.2 | v71.4,19.01 71.4,18.65 71.42,18.63 71.42,18.21 72.07,17.57 72.07,17.13 72.3,16.9 72.87,16.9 73.39,16.38 74.03,16.38 v74.67,17.01 74.85,17.01 75.47,17.63 75.47,17.64 IC1.7 | U$27.T2 90.15,2.68 92.15,2.68 92.47,3 92.47,3.46 89.31,6.62 88.1,6.62 87.35,5.87 85.68,5.87 81.06,10.49 v81.06,10.5
  Bottom 0.152: C11.1 R16.2 | U$3.POWER_3 66.16,18.8 66.3,18.8 66.35,18.75 71.15,18.75 v71.4,19.01 | v81.06,10.5 80.81,10.75 80.52,10.75 80.2,11.07 80.2,11.36 76.32,15.24 74.89,15.24 74.16,15.98 74.16,16.44 74.67,16.95 v74.67,17.01
  other vias: 90.17,1.53
P0_GPIO  (via drill 0.6)
  Top 0.152: IC1.31 82.36,25.24 89.38,25.24 P0_GPIO.TP
  Top 0.813: v90.49,24.92 P0_GPIO.TP
P0_IR  (via drill 0.35, 0.6)
  Top 0.152: v83,17.76 82.92,17.76 IC1.19
  Top 0.813: v90.49,26.03 P0_IR.TP
  Bottom 0.152: v83,17.76 83,19.28 84.86,21.14 86.63,21.14 89.81,24.32 89.81,25.21 90.49,25.89 v90.49,26.03
P0_OUT  (via drill 0.6)
  Top 0.152: IC1.29 83.16,24.63 85.41,24.63 86.53,23.51 86.84,23.2 87.06,23.2 87.64,22.61 87.64,19.83 89.22,18.26 P0_OUT.TP
  Top 0.813: v90.49,18.26 P0_OUT.TP
P0_XSHUT  (via drill 0.6)
  Top 0.152: IC1.30 82.76,24.94 88.46,24.94 89.15,24.25 89.26,24.25 P0_XSHUT.TP
  Top 0.813: v90.49,23.81 P0_XSHUT.TP
P1_GPIO  (via drill 0.35, 0.6)
  Top 0.152: P1_GPIO.TP 87.31,10.43 87.31,10.48 87.31,10.79 87.83,11.31 87.83,14.11 86.49,15.45 85.78,15.45 85.44,15.79 v85.44,16.57 | v85.41,18.61 85.92,19.13 85.92,22.82 85.54,23.2 84.56,23.2 IC1.25
  Top 0.813: v88.26,9.48 P1_GPIO.TP
  Bottom 0.152: v85.44,16.57 85.44,17.79 85.42,17.81 85.42,18.6 v85.41,18.61
P1_IR  (via drill 0.6)
  Top 0.152: IC1.18 86.36,13.62 86.36,9.81 P1_IR.TP
  Top 0.813: v87.48,8.69 P1_IR.TP
P1_OUT  (via drill 0.6)
  Top 0.152: P1_OUT.TP 91.81,14.75 91.73,14.83 90.49,14.83 90.42,14.83 88.83,14.83 86.53,17.13 86.53,23.08 85.8,23.81 83.75,23.81 IC1.27
  Top 0.813: v92.98,14.19 P1_OUT.TP
P1_XSHUT  (via drill 0.35, 0.6)
  Top 0.152: IC1.26 84.16,23.51 85.67,23.51 86.23,22.95 86.23,18.29 v85.97,18.04 | v86.01,16 86.37,16 88.13,14.24 88.13,11.18 P1_XSHUT.TP
  Top 0.813: v89.05,10.26 P1_XSHUT.TP
  Bottom 0.152: v86.01,16 86.01,18.01 v85.97,18.04
P2_GPIO  (via drill 0.35, 0.6)
  Top 0.152: P2_GPIO.TP 85.75,11.38 85.75,13.36 82.42,16.7 82.28,16.7 v82.17,16.59 | v78.25,25.07 77.89,25.07 77.88,25.08 77.72,25.08 IC1.39
  Top 0.813: v83.87,9.5 P2_GPIO.TP | P2_GPIO.TP
  Bottom 0.152: v82.17,16.59 82.09,16.67 81.73,16.67 80.62,17.78 80.62,23.2 79.01,24.82 78.5,24.82 v78.25,25.07
P2_IR  (via drill 0.6)
  Top 0.152: P2_IR.TP 86.06,10.11 86.06,13.49 82.4,17.14 82.12,17.14 IC1.17
  Top 0.813: v84.66,8.72 P2_IR.TP
P2_OUT  (via drill 0.6)
  Top 0.152: P2_OUT.TP 79.72,15.39 79.8,15.47 79.8,15.66 78.9,16.56 78.9,22.49 IC1.41
  Top 0.813: v79.16,14.22 P2_OUT.TP | P2_OUT.TP
P2_XSHUT  (via drill 0.35, 0.6)
  Top 0.152: P2_XSHUT.TP 84.07,11.27 85.21,11.27 85.45,11.51 85.45,13.24 82.88,15.8 v82.53,15.8 | v77.65,24.53 77.57,24.53 IC1.40
  Top 0.813: v83.09,10.29 P2_XSHUT.TP
  Bottom 0.152: v82.53,15.8 82.3,16.03 81.94,16.03 80.32,17.66 80.32,23.08 78.88,24.51 77.66,24.51 v77.65,24.53
P3_GPIO  (via drill 0.35, 0.6)
  Top 0.152: v65.41,16 65.82,16 66.09,16.26 70.86,16.26 71.46,16.86 71.46,17.32 70.81,17.96 70.81,18.37 69.23,19.96 69.23,22.9 70.36,24.03 74.29,24.03 74.59,23.73 IC1.45
  Top 0.813: v64.45,13.97 P3_GPIO.TP
  Bottom 0.152: v64.45,13.97 65.41,14.92 v65.41,16
P3_IR  (via drill 0.35, 0.6)
  Top 0.152: v79.45,18.24 80.32,18.24 IC1.16 | P3_IR.TP 63.77,15.2 63.77,15.31 63.91,15.44 65.7,15.44 66.21,15.96 74.46,15.96 v74.71,16.21
  Top 0.813: v63.34,13.97 P3_IR.TP
  Bottom 0.152: v79.45,18.24 78.11,18.24 77.32,19.03 77.06,19.03 75.26,17.24 75.26,16.76 v74.71,16.21
P3_OUT  (via drill 0.35, 0.6)
  Top 0.152: IC1.46 74.24,23.38 73.94,23.67 70.43,23.67 69.53,22.78 69.53,20.09 71.12,18.5 71.12,18.09 71.76,17.45 71.76,16.65 v71.9,16.51
  Top 0.813: v71.12,13.97 P3_OUT.TP
  Bottom 0.152: v71.9,16.51 71.12,15.74 v71.12,13.97
P3_XSHUT  (via drill 0.35, 0.6)
  Top 0.152: P3_XSHUT.TP 66,15.2 66,15.31 66.34,15.65 69.53,15.65 69.85,15.65 77.47,15.65 78.59,16.77 78.59,18.89 78.44,19.05 v78.34,19.05 | v79.45,19.05 81.85,19.05 81.88,19.08 82.31,19.08 IC1.20
  Top 0.813: v65.56,13.97 P3_XSHUT.TP
  Bottom 0.152: v78.34,19.05 v79.45,19.05
RGB  (1 unrouted)
RGB_EXT  (via drill 0.35)
  Top 0.152: v85.89,7.31 85.89,7.35 D3.2 | v73.62,16.93 73.62,17.29 73.55,17.36 73.55,18.86 v72.8,19.62
  Bottom 0.152: U$1.POWER_2 63.95,22.23 64.05,22.23 65.42,20.86 66.56,20.86 67.75,19.67 70.42,19.67 70.92,20.17 71.88,20.17 72.44,19.62 v72.8,19.62 | v85.89,7.31 83.47,7.31 77.83,12.95 77.83,13.14 76.03,14.94 74.77,14.94 73.85,15.85 73.85,16.6 73.62,16.84 v73.62,16.93
S0_3V3  (via drill 0.55, 0.6)
  Top 0.254: 11.85,23.07 10.79,24.13 VL0_11.TP | S0_3V3.TP 16.57,20.8 R1.2 14,22.79 13,22.79 12.72,23.07 11.85,23.07 | 11.85,23.07 11.66,22.89 11.66,21.67 11.25,21.26 10.36,21.26 9.37,20.26
  Bottom 0.254: C1.2 10.79,25.18 VL0_11.TP | R2.2 R1.2
  other vias: 10.79,24.77 14.29,23.08
S0_5V
  Top 0.254: S0_5V.TP 27.08,19.3 18.97,19.3 16.5,16.83 JP1.1
S0_GND  (via drill 0.55, 0.6)
  Top 0.254: S0_GND.TP 27,17.46 26.39,18.07 25.36,18.07 24.12,16.83 JP4.1 | v14.73,18.81 13.41,18.81 v13.02,18.41
  Bottom 0.254: 11.55,17.78 R3.2 12.38,17.78 v13.02,18.41 | 10.95,23.18 11.91,24.13 VL0_12.TP 11.91,25.77 C1.1 13.19,26.03 13.36,26.2 16.27,26.2 18.12,24.36 18.12,20.46 18.23,20.35 | JP4.1 23.34,18.57 | 23.34,18.57 C0.2 | 18.23,20.35 R0.1 18.77,19.86 19.09,19.86 20.38,18.57 23.34,18.57 | 18.23,20.35 17.74,19.86 16.21,19.86 15.16,18.81 v14.73,18.81
  other vias: 11.91,24.77
S0_GPIO  (via drill 0.55, 0.6)
  Top 0.254: VL0_8.TP 11.17,19.43 11.17,19.62 11.34,19.78 12.12,19.78 13.16,20.82 v13.16,21.68 | S0_GPIO.TP 17.74,25.24 v16.99,24.49
  Bottom 0.254: v13.16,21.68 13.46,21.98 13.46,21.99 13.62,22.15 15.1,22.15 R2.1 16.87,22.37 17.3,22.37 17.71,22.78 17.71,23.37 16.99,24.09 v16.99,24.49
  other vias: 10.79,19.05
S0_OUT  (via drill 0.55)
  Top 0.254: JP3.1 21.58,16.83 23.23,18.48 27.37,18.48 S0_OUT.TP | v15.72,18.37 15.42,18.07 15.2,18.07 14.84,17.71 11.78,17.71 LED3.A
  Bottom 0.254: v15.72,18.37 16.51,18.37 17.59,19.46 18.92,19.46 19.09,19.29 19.09,18.54 JP3.1
S0_SCL  (via drill 0.55)
  Top 0.254: S0_SCL.TP 17.06,23.02 v17,23.07 | v13.88,24.49 13.48,24.49 12.47,25.5 10.23,25.5 10.06,25.33 10.06,25.14 VL0_10.TP
  Bottom 0.254: v17,23.07 16.7,23.38 16.7,23.69 15.91,24.49 v13.88,24.49
  other vias: 9.68,24.77
S0_SDA  (via drill 0.55, 0.6)
  Top 0.254: VL0_9.TP 10.06,19.43 10.06,19.62 10.63,20.19 11.49,20.19 v12.11,20.81 | v17.14,21.5 26.88,21.5 26.9,21.53 27.08,21.53 S0_SDA.TP
  Bottom 0.254: v17.14,21.5 16.7,21.06 16.7,20.76 16.54,20.6 13.81,20.6 13.62,20.6 12.32,20.6 v12.11,20.81
  other vias: 9.68,19.05
S0_XSHUT  (via drill 0.55, 0.6)
  Top 0.254: VL0_7.TP 11.96,19.05 R1.1 13.86,21.8 13.86,21.97 13.45,22.38 12.87,22.38 12.85,22.37 v12.42,22.37 | S0_XSHUT.TP 27.38,24.05 27.12,23.78 13.99,23.78 13.85,23.63 v13.16,23.63
  Bottom 0.254: v12.42,22.37 13.16,23.1 v13.16,23.63
  other vias: 11.91,19.05 14.29,21.38
SCL  (via drill 0.35, 0.6)
  Top 0.152: IC1.21 83.84,18.26 84.55,18.26 88.44,14.36 88.44,12.45 89.5,11.39 | SCL_2.TP 83.05,11.83 | v90.49,22.7 95.9,17.29 97.38,17.29 97.51,17.15 97.51,15.87 96.78,15.14 R10.1 95.47,14.76 91.86,11.15 89.94,11.15 v89.84,11.05 89.73,10.94 89.73,9.98 86.3,6.55 85.86,6.55 82.41,10.01 82.41,10.97 v82.3,11.07 | v66.67,13.97 67.47,13.18 68.15,13.18 69.77,11.56 80.5,11.56 v80.75,11.3
  Top 0.813: v90.49,22.7 SCL.TP | v89.84,11.05 89.5,11.39 SCL_1.TP | SCL_1.TP | v82.3,11.07 SCL_2.TP | SCL_2.TP | v66.67,13.97 SCL_3.TP
  Bottom 0.152: v80.75,11.3 81.11,11.3 81.23,11.18 82.2,11.18 v82.3,11.07
SCL_2  (via drill 0.35)
  Top 0.152: v77.61,22.99 75.89,24.71 IC1.42 75.46,25.22 v75.46,25.75
  Bottom 0.152: U$3.SIGNAL_1 64.46,18.45 64.46,19.63 65.39,20.56 66.43,20.56 67.62,19.37 70.55,19.37 71.04,19.87 71.76,19.87 72.56,19.06 73.6,19.06 76.48,21.94 76.48,22.65 76.81,22.98 77.14,22.98 77.15,22.99 | 76.83,22.99 77.15,22.99 | 77.15,22.99 v77.61,22.99 | R13.1 76.04,25.17 v75.46,25.75
SDA  (via drill 0.35, 0.6)
  Top 0.152: SDA_1.TP 88.74,13.71 88.74,14.49 84.66,18.57 84.23,18.57 IC1.22 | R11.1 96.65,16.38 | 96.65,16.38 92.11,11.83 v90.62,11.83 | SDA.TP 90.12,21.16 90.77,21.16 95.55,16.38 96.65,16.38 | v90.7,10.6 90.04,9.93 90.04,9.85 86.43,6.25 85.74,6.25 81.62,10.36 81.62,11.76 v81.52,11.86 69.9,11.86 v67.79,13.97
  Top 0.813: v90.49,21.59 SDA.TP | v90.62,11.83 SDA_1.TP | SDA_1.TP | v81.52,11.86 SDA_2.TP | v67.79,13.97 SDA_3.TP
  Bottom 0.152: v90.7,10.6 90.7,11.75 v90.62,11.83
SDA_2  (via drill 0.35)
  Top 0.152: v77.04,22.42 77.04,22.94 IC1.43 74.74,25.23 v74.74,25.31
  Bottom 0.152: U$3.SIGNAL_2 64.77,18.05 64.77,19.5 65.51,20.25 66.3,20.25 67.5,19.06 70.67,19.06 71.17,19.56 71.63,19.56 72.44,18.75 73.73,18.75 77.04,22.07 v77.04,22.42 | v74.74,25.31 R12.1
SWCLK  (via drill 0.35)
  Top 0.152: IC1.37 77.99,26.23 78.22,26 78.81,25.41 78.81,24.84 78.22,24.25 v78.22,23.96
  Bottom 0.152: U$3.SIGNAL_4 65.96,18.1 66.3,18.1 66.35,18.14 69.37,18.14 73.98,18.14 78.67,22.83 79.02,22.83 79.35,23.16 79.35,23.62 79.02,23.94 78.23,23.94 v78.22,23.96
SWDIO  (via drill 0.35)
  Top 0.152: v78.79,23.39 78.79,23.8 IC1.34
  Bottom 0.152: U$3.SIGNAL_3 71.12,18.45 73.85,18.45 v78.79,23.39
USBDM
  Top 0.152: R8.1 USB.1
USBDP
  Top 0.152: R7.1 95.25,30.32 USB.2 95.83,30.06 R9.1
(copper drawn outside any net)
  shapes: Top area x5

### Text on the board
Top: PRAWY I LEWY SOKET NA CZUJNIKI | PRAWY I LEWY SOKET NA CZUJNIKI | PRAWY I LEWY SOKET NA CZUJNIKI
tPlace: LISTYW LED!!! | LISTYW LED!!! | LISTYW LED!!! | LISTYW LED!!! | LISTYW LED!!! | LISTYW LED!!! | LISTYW LED!!!